# EAGLE schematic arduino-doorbell (EAGLE 7.7.0)
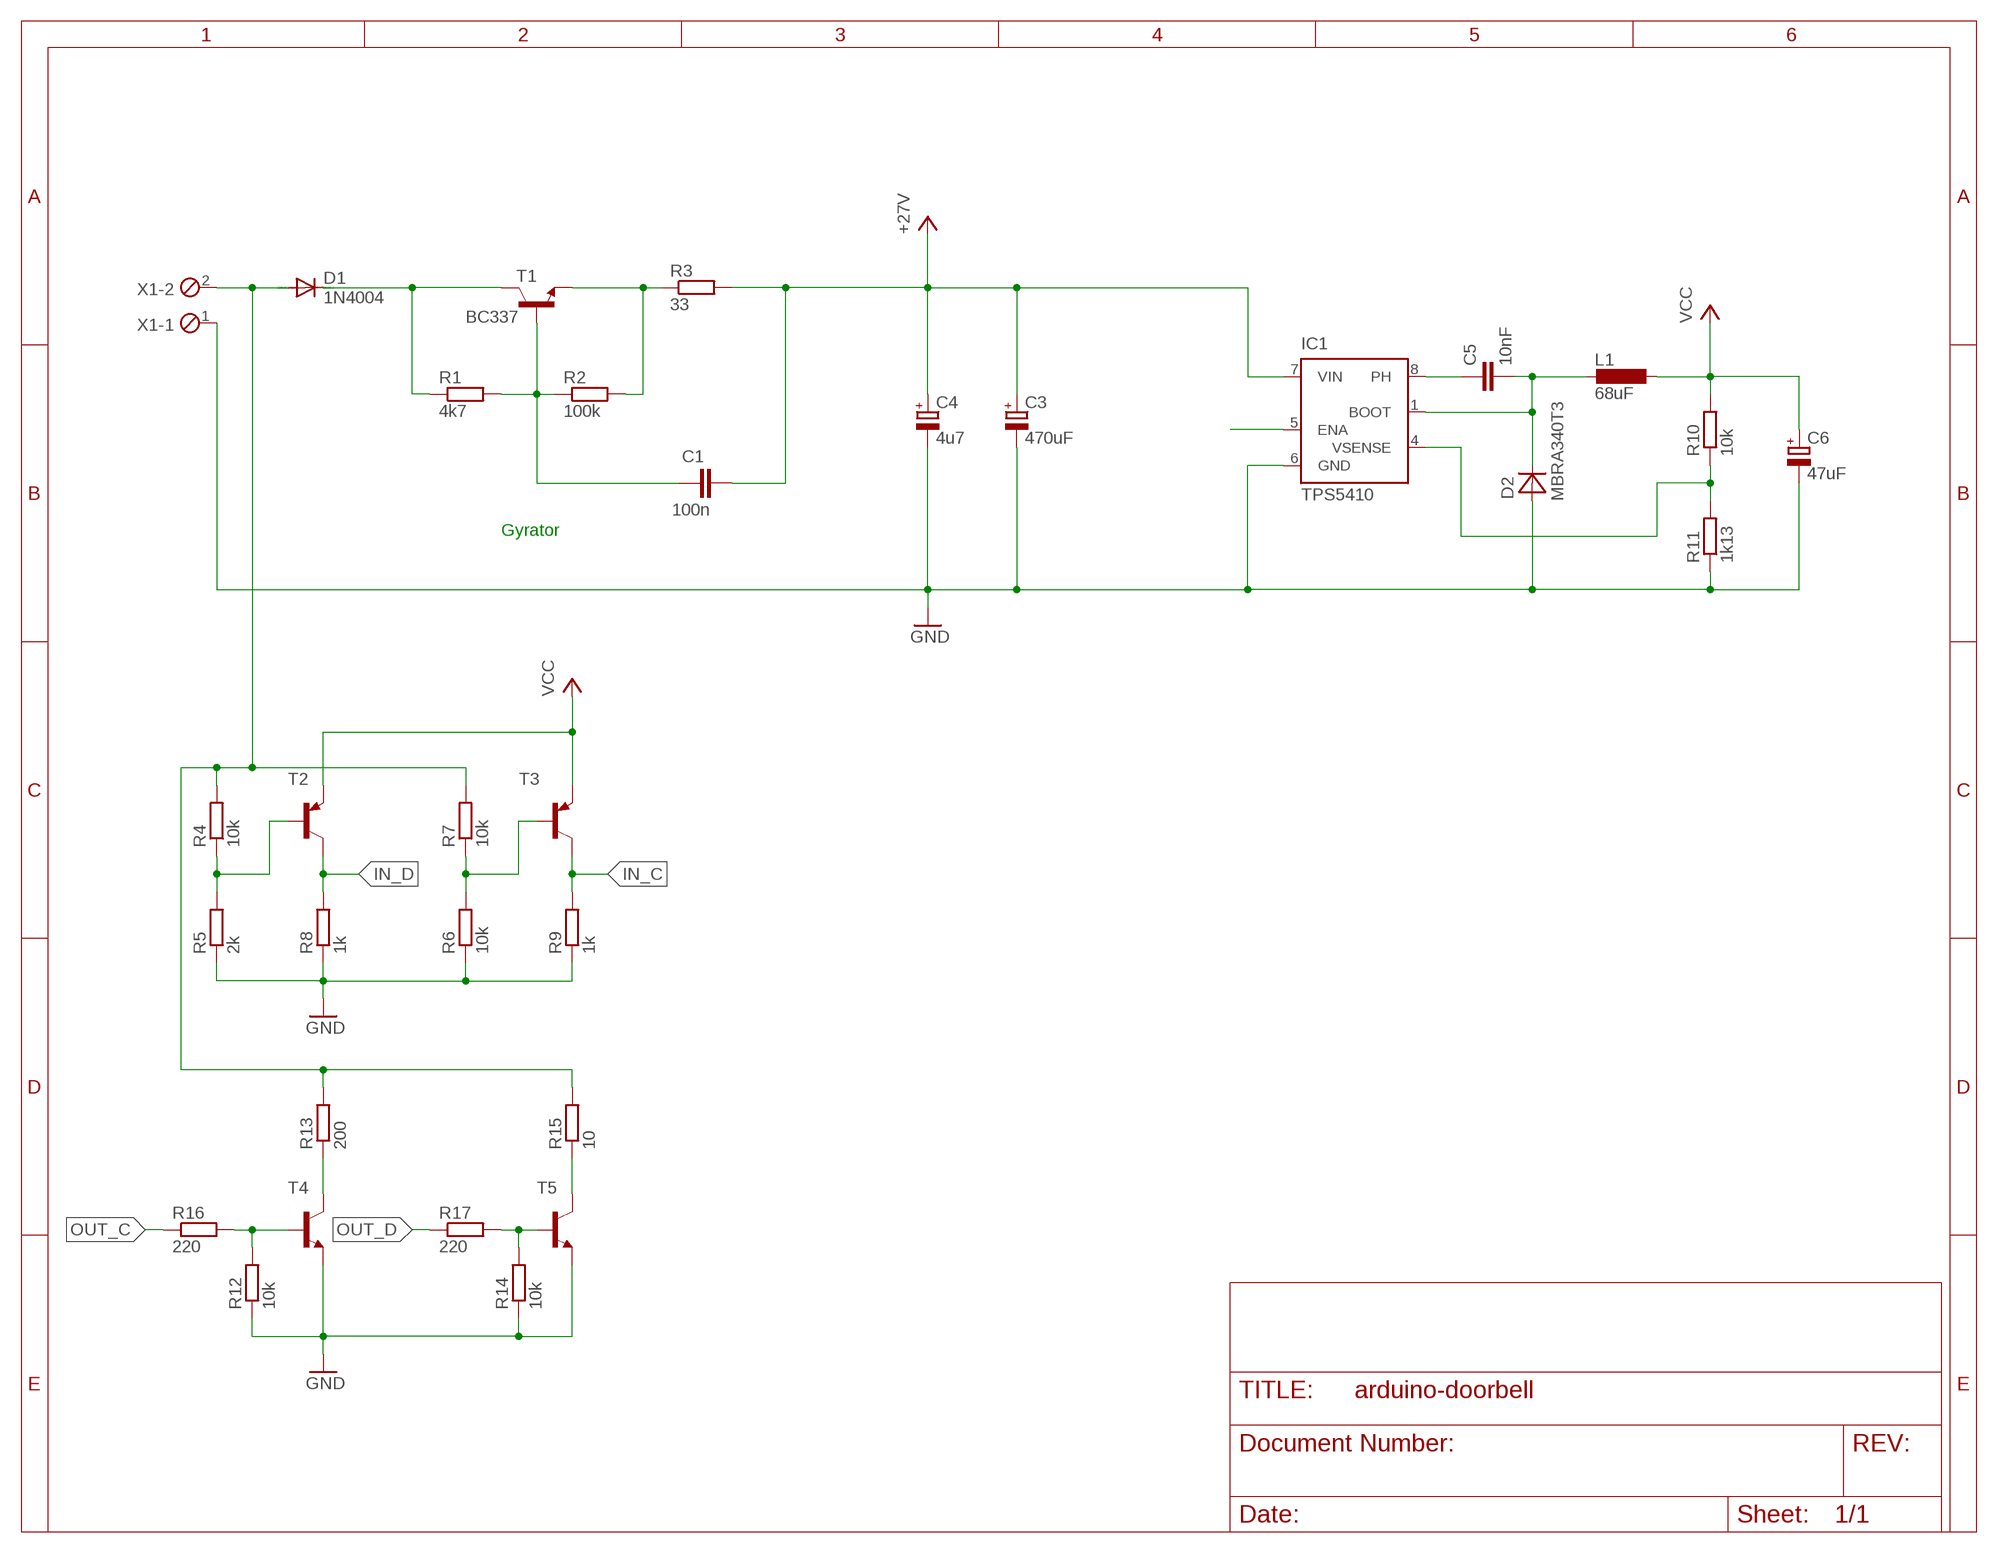
[diagram p0: schematic, sheet 1]

## Parts
C1  100n  C-EU050-025X075  [C050-025X075]
C3  470uF  CPOL-EUE3.5-10  [E3,5-10]
C4  4u7  CPOL-EUE3.5-10  [E3,5-10]
C5  10nF  C-EU025-030X050  [C025-030X050]
C6  47uF  CPOL-EUE3.5-10  [E3,5-10]
D1  1N4004  [DO41-10]
D2  MBRA340T3  [SMA]
IC1  TPS5410  [D_R-PDSO-G08]
L1  68uF  DO3316P  [DO3316P]
R1  4k7  R-EU_0204/5  [0204/5]
R2  100k  R-EU_0204/5  [0204/5]
R3  33  R-EU_0204/5  [0204/5]
R4  10k  R-EU_0204/5  [0204/5]
R5  2k  R-EU_0204/5  [0204/5]
R6  10k  R-EU_0204/5  [0204/5]
R7  10k  R-EU_0204/5  [0204/5]
R8  1k  R-EU_0204/5  [0204/5]
R9  1k  R-EU_0204/5  [0204/5]
R10  10k  R-EU_0204/5  [0204/5]
R11  1k13  R-EU_0204/5  [0204/5]
R12  10k  R-EU_0204/5  [0204/5]
R13  200  R-EU_0204/5  [0204/5]
R14  10k  R-EU_0204/5  [0204/5]
R15  10  R-EU_0204/5  [0204/5]
R16  220  R-EU_0204/5  [0204/5]
R17  220  R-EU_0204/5  [0204/5]
T1  BC337  [TO92]
T2  -PNP-TO92  [TO92]
T3  -PNP-TO92  [TO92]
T4  -NPN-SOT23-EBC  [SOT23-EBC]
T5  -NPN-SOT23-EBC  [SOT23-EBC]
X1  MPT2  [2POL254]

## Nets
+27V: C1.2 C3.+ C4.+ IC1.7(VIN) R3.2
GND: C3.- C4.- C6.- D2.A IC1.6(GND) R5.1 R6.1 R8.1 R9.1 R11.1 R12.1 R14.1 T4.E T5.E X1.1
IN_C: R9.2 T3.3(C)
IN_D: R8.2 T2.3(C)
N$1: C1.1 R1.2 R2.1 T1.2(B)
N$2: R2.2 R3.1 T1.1(E)
N$3: R4.1 R5.2 T2.2(B)
N$4: D1.C R1.1 T1.3(C)
N$5: IC1.5(ENA)
N$6: C5.1 IC1.8(PH)
N$7: R6.2 R7.1 T3.2(B)
N$10: C5.2 D2.C IC1.1(BOOT) L1.1
N$11: IC1.4(VSENSE) R10.1 R11.2
N$14: R12.2 R16.2 T4.B
N$15: R13.1 T4.C
N$16: R14.2 R17.2 T5.B
N$17: R15.1 T5.C
OUT_C: R16.1
OUT_D: R17.1
VCC: C6.+ L1.2 R10.2 T2.1(E) T3.1(E)
X1: D1.A R4.2 R7.2 R13.2 R15.2 X1.2

## Notes on the sheet
- Gyrator

## Library data of the parts
C1 C5 = rcl:C-EU: CAPACITOR, European symbol
C3 C4 C6 = rcl:CPOL-EU: POLARIZED CAPACITOR, European symbol
D1 = diode:1N4004: DIODE general purpose rectifier, 1 A
D2 = diode:MBRA340T3: Surface Mount Schottky Power Rectifier Source: http://www.onsemi.com/pub_link/Collateral/MBRA340T3-D.PDF
IC1 = texas:TPS5410: 1-A, WIDE INPUT RANGE, STEP-DOWN SWIFT? CONVERTER Source: U7 Texas TPS5410 Step Down Converter.pdf; MPN: TPS5410DR; OC_FARNELL: 1329596; OC_NEWARK: 18M3223
L1 = inductor-coilcraft:DO3316P: COILCRAFT; MF: MSS1260-683MLD; OC_FARNELL: unknown; OC_NEWARK: unknown
R1-R17 = rcl:R-EU_: RESISTOR, European symbol
T1 = transistor:BC337: NPN TRANSISTOR
T2 T3 = transistor:*-PNP-: PNP Transistror
T4 T5 = transistor:*-NPN-: NPN Transistror BF959 corrected 2008.03.06
X1 = con-phoenix-254:MPT2: PHOENIX CONNECTOR; OC_FARNELL: unknown; OC_NEWARK: unknown